# Altium schematic sheet gyroscope.SchDoc
size A4
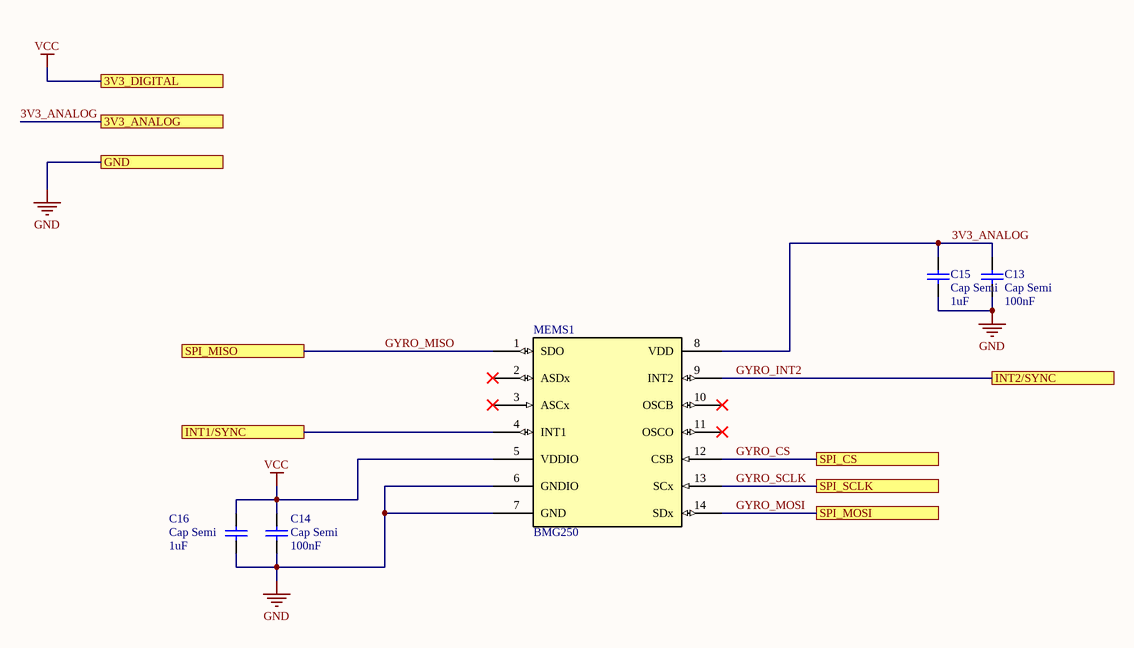
[diagram p0: gyroscope.SchDoc]

## Parts
C13  Cap Semi  value 100nF  [C1206]
C14  Cap Semi  value 100nF  [C1206]
C15  Cap Semi  value 1uF  [C1210]
C16  Cap Semi  value 1uF  [C1210]
MEMS1  BMG250  [LGA14-BOSCH]

## Ports
3V3_ANALOG, 3V3_DIGITAL, GND, INT1/SYNC, INT2/SYNC, SPI_CS, SPI_MISO, SPI_MOSI, SPI_SCLK

## Nets
GND: C13.1 C14.1 C15.1 C16.1 MEMS1.6(GNDIO) MEMS1.7(GND) ; port GND
VCC: C14.2 C16.2 MEMS1.5(VDDIO) ; port 3V3_DIGITAL
3V3_ANALOG: C13.2 C15.2 MEMS1.8(VDD) ; port 3V3_ANALOG
GYRO_CS: MEMS1.12(CSB) ; port SPI_CS
GYRO_INT2: MEMS1.9(INT2) ; port INT2/SYNC
GYRO_MISO: MEMS1.1(SDO) ; port SPI_MISO
GYRO_MOSI: MEMS1.14(SDx) ; port SPI_MOSI
GYRO_SCLK: MEMS1.13(SCx) ; port SPI_SCLK
INT1/SYNC: MEMS1.4(INT1) ; port INT1/SYNC

Not connected (* = marked no-connect by the designer): MEMS1 2(ASDx)* 3(ASCx)* 10(OSCB)* 11(OSCO)*

## Library data of the parts
C13-C16 = Cap Semi: Capacitor (Semiconductor SIM Model); Published: 8-Jun-2000; LatestRevisionDate: 29-May-2009; LatestRevisionNote: IPC-7351 Footprint Added.; PackageReference: C1206; Publisher: Altium Limited; PackageDescription: Chip Capacitor